# EAGLE design cape (EAGLE 9.4.0)
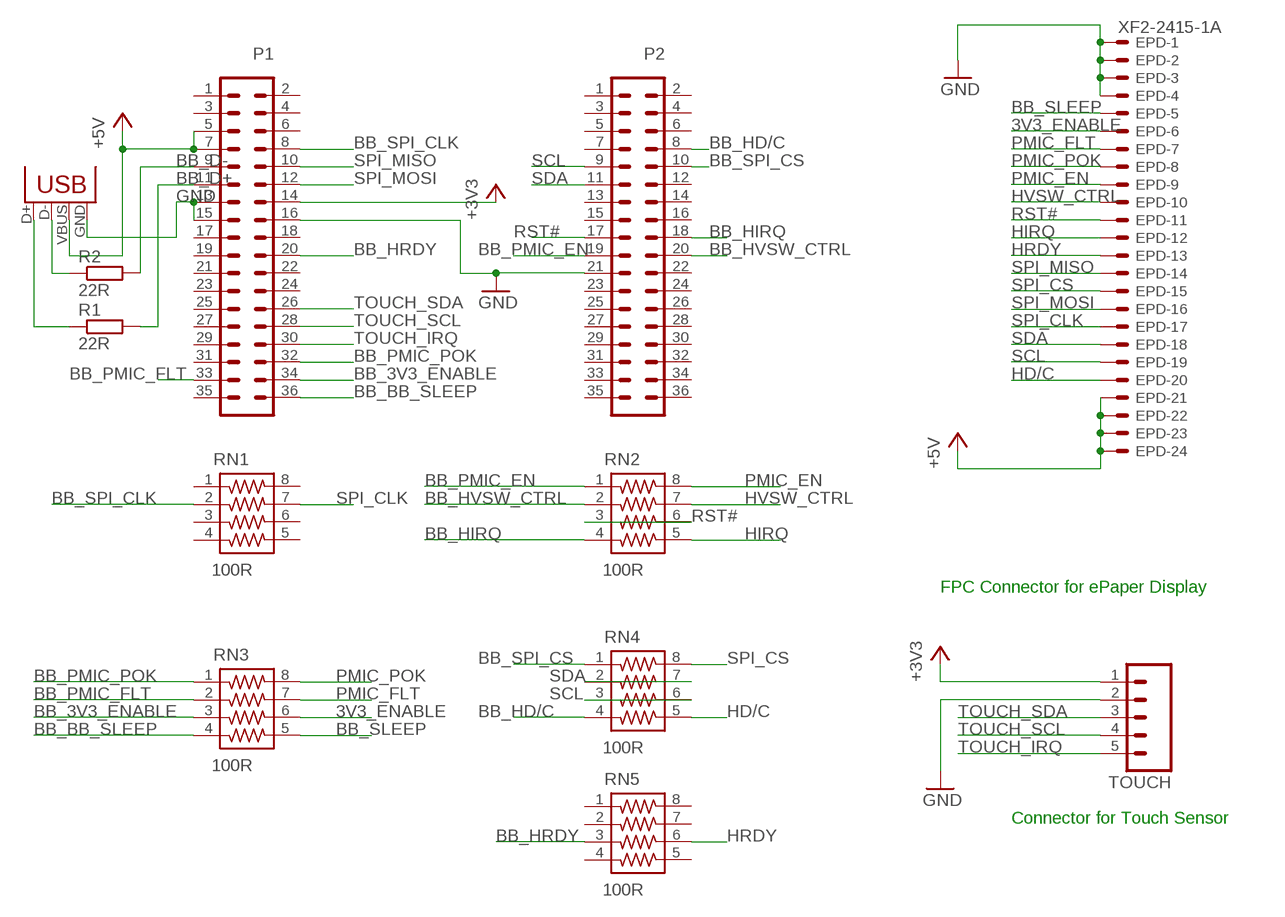
[diagram p0: schematic, sheet 1]

## Parts
EPD  XF2-2415-1A  [XF2M-2415-1A]
P1  MA18-2  [MA18-2]
P2  MA18-2  [MA18-2]
R1  22R  R-EU_R0603  [R0603]
R2  22R  R-EU_R0603  [R0603]
RN1  100R  741-8  [741-8]
RN2  100R  741-8  [741-8]
RN3  100R  741-8  [741-8]
RN4  100R  741-8  [741-8]
RN5  100R  741-8  [741-8]
TOUCH  M05PTH  [1X05]
USB  USB-A-H  [USB-A-H]

## Nets
3V3_ENABLE: EPD.6 RN3.6
+3V3: P1.14 TOUCH.1
+5V: EPD.21 EPD.22 EPD.23 EPD.24 P1.5 P1.7 USB.VBUS
BB_3V3_ENABLE: P1.34 RN3.3
BB_BB_SLEEP: P1.36 RN3.4
BB_D+: P1.11 R1.2
BB_D-: P1.9 R2.2
BB_HD/C: P2.8 RN4.4
BB_HIRQ: P2.18 RN2.4
BB_HRDY: P1.20 RN5.3
BB_HVSW_CTRL: P2.20 RN2.2
BB_PMIC_EN: P2.19 RN2.1
BB_PMIC_FLT: P1.33 RN3.2
BB_PMIC_POK: P1.32 RN3.1
BB_SLEEP: EPD.5 RN3.5
BB_SPI_CLK: P1.8 RN1.2
BB_SPI_CS: P2.10 RN4.1
D+: R1.1 USB.D+
D-: R2.1 USB.D-
GND: EPD.1 EPD.2 EPD.3 EPD.4 P1.13 P1.15 P1.16 P2.21 TOUCH.2 USB.GND
HD/C: EPD.20 RN4.5
HIRQ: EPD.12 RN2.5
HRDY: EPD.13 RN5.6
HVSW_CTRL: EPD.10 RN2.7
PMIC_EN: EPD.9 RN2.8
PMIC_FLT: EPD.7 RN3.7
PMIC_POK: EPD.8 RN3.8
RST#: EPD.11 P2.17 RN2.3 RN2.6
SCL: EPD.19 P2.9 RN4.3 RN4.6
SDA: EPD.18 P2.11 RN4.2 RN4.7
SPI_CLK: EPD.17 RN1.7
SPI_CS: EPD.15 RN4.8
SPI_MISO: EPD.14 P1.10
SPI_MOSI: EPD.16 P1.12
TOUCH_IRQ: P1.30 TOUCH.5
TOUCH_SCL: P1.28 TOUCH.4
TOUCH_SDA: P1.26 TOUCH.3
Unconnected: P1.1 P1.2 P1.3 P1.4 P1.6 P1.17 P1.18 P1.19 P1.21 P1.22 P1.23 P1.24 P1.25 P1.27 P1.29 P1.31 P1.35 P2.1 P2.2 P2.3 P2.4 P2.5 P2.6 P2.7 P2.12 P2.13 P2.14 P2.15 P2.16 P2.22 P2.23 P2.24 P2.25 P2.26 P2.27 P2.28 P2.29 P2.30 P2.31 P2.32 P2.33 P2.34 P2.35 P2.36 RN1.1 RN1.3 RN1.4 RN1.5 RN1.6 RN1.8 RN5.1 RN5.2 RN5.4 RN5.5 RN5.7 RN5.8

## Notes on the sheet
- FPC Connector for ePaper Display
- Connector for Touch Sensor

## Library data of the parts
EPD = con-omron:XF2*-24?: OMRON FPC Connector Source : http://www.omron.com/ecb/products/pdf/fpc.pdf
P1 P2 = con-lstb:MA18-2: PIN HEADER; OC_FARNELL: unknown; OC_NEWARK: unknown
R1 R2 = rcl:R-EU_: RESISTOR, European symbol; SPICEPREFIX: R
RN1-RN5 = resistor-array:741-8: CTS 741 Series 8 Terminations, 4 Resistors
TOUCH = SparkFun:M05: Header 5 Standard 5-pin 0.1" header. Use with straight break away headers (SKU : PRT-00116), right angle break away headers (PRT-00553), swiss pins (PRT-00743), machine pins (PRT-00117), and female headers (PRT-00115). Molex polarized connector foot print use with SKU : PRT-08230 with associated crimp pins and housings.
USB = con-usb:USB: USB Connectors

## Board
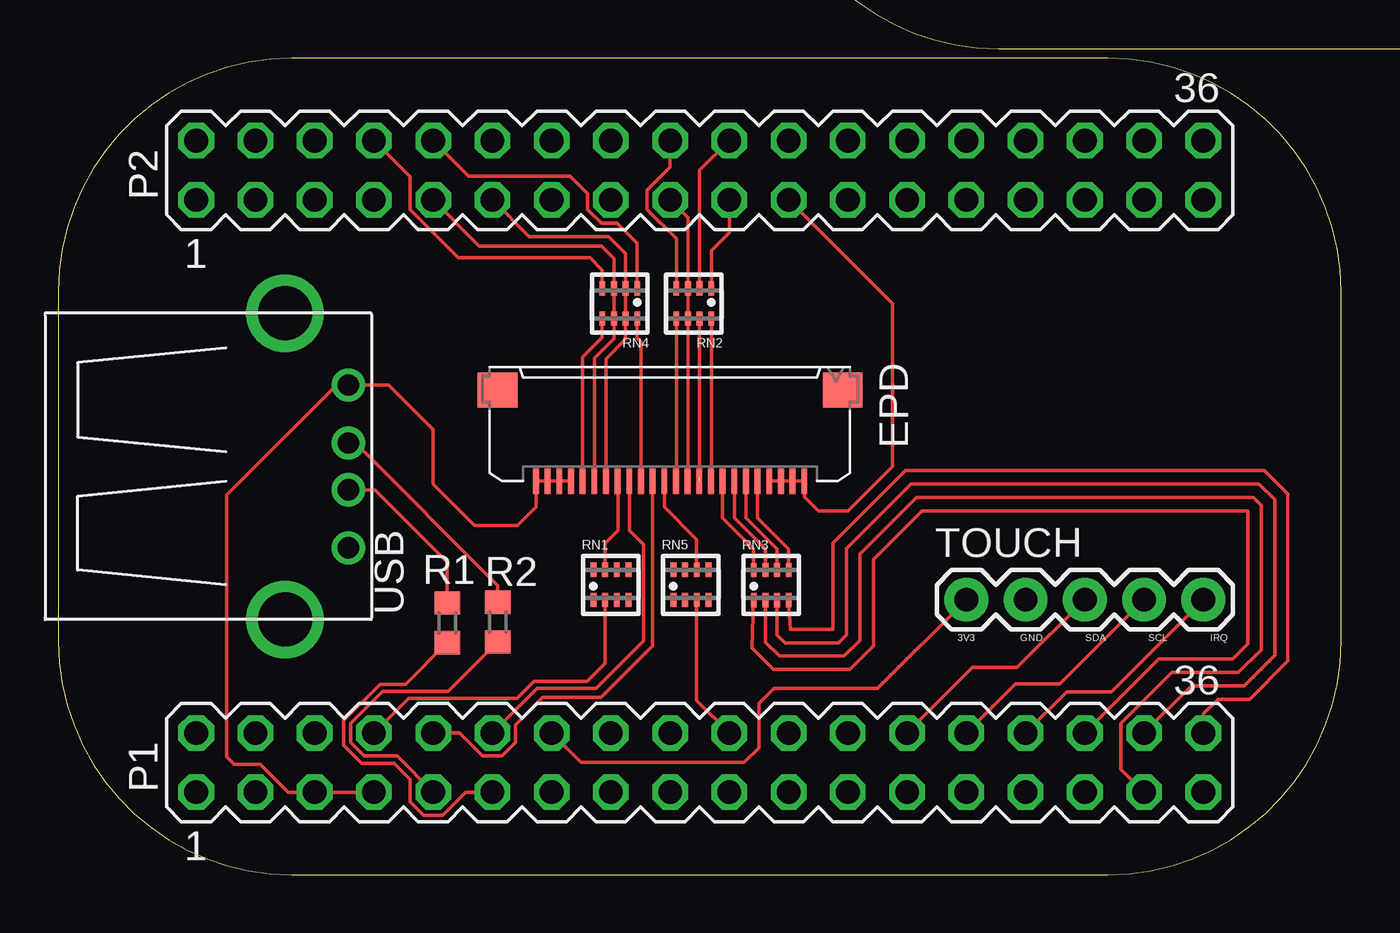
[diagram p1: board, top side]
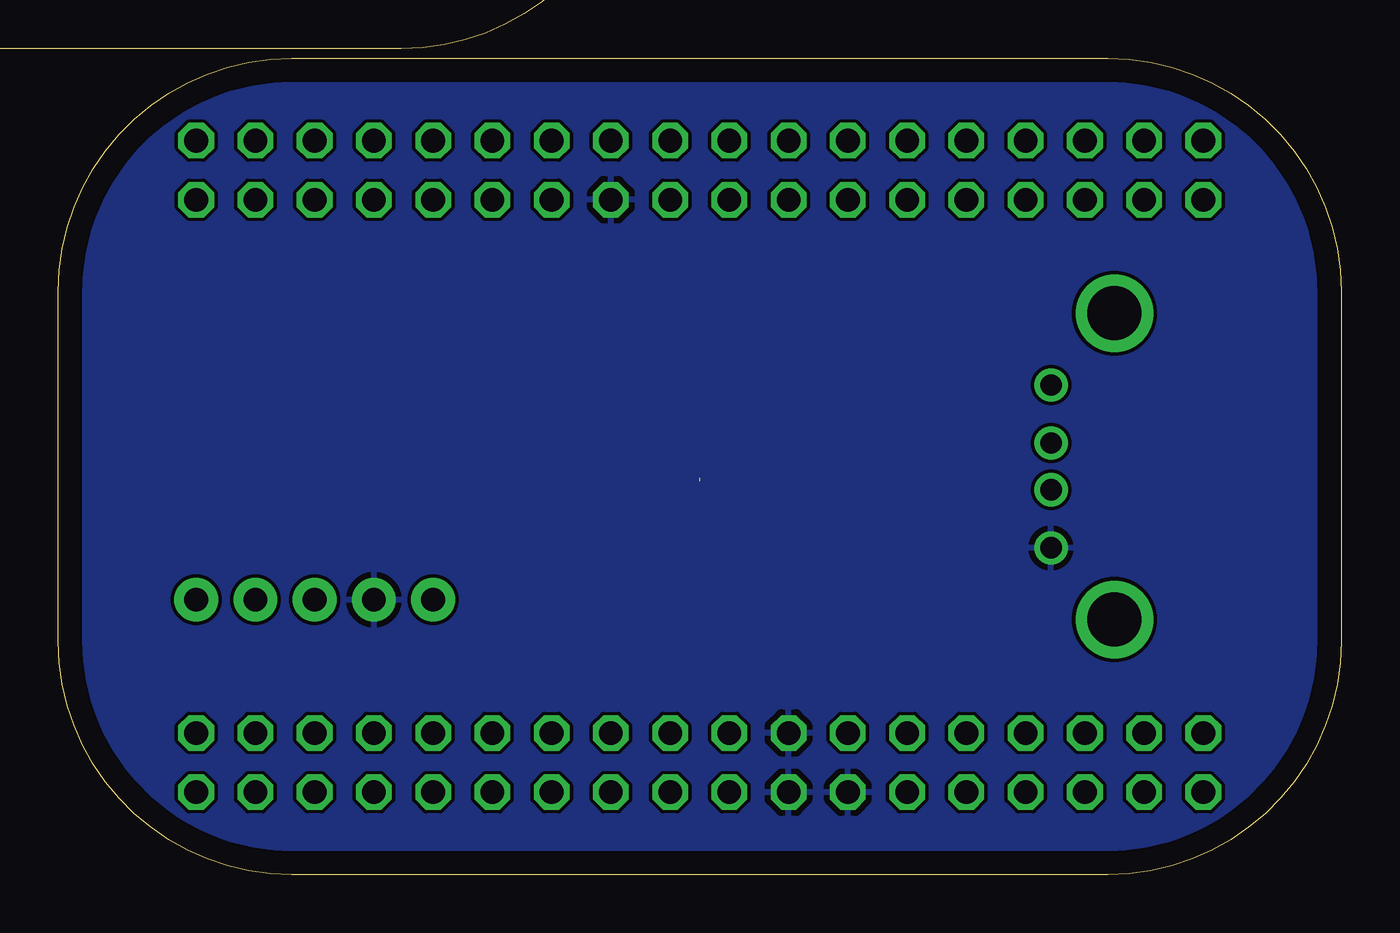
[diagram p2: board, bottom side, seen from below]

Size 55 x 35 mm. Coordinates in mm from the lower left corner, seen from the top.
Outline: 45,35 10,35 arc90 0,25 0,10 arc90 10,0 45,0 arc90 55,10 55,25 arc90 45,35
Copper layers (1*16): Top 0.035mm / dielectric 1.5mm / Bottom 0.035mm
Design rules "default": minimum track width 6mil, minimum drill 0.35mm, track to track 6mil, track to pad 6mil, pad to pad 6mil, via to via 6mil, smd to smd 6mil, copper to edge 40mil, drill to drill 6mil, minimum pad ring 10mil, minimum via ring 8mil, stop-mask expansion 4mil, vias tented up to drill 0mil, thermal gap 10mil
Milling: 8 lines

### Footprints (pad centres in the part's own frame; a part is rotated, then mirrored left to right if it is on the bottom)
XF2M-2415-1A = smd 1.1 x 0.25: 1 2.54,5.75; 2 2.54,5.25; 3 2.54,4.75; 4 2.54,4.25; 5 2.54,3.75; 6 2.54,3.25; 7 2.54,2.75; 8 2.54,2.25; 9 2.54,1.75; 10 2.54,1.25; 11 2.54,0.75; 12 2.54,0.25; 13 2.54,-0.25; 14 2.54,-0.75; 15 2.54,-1.25; 16 2.54,-1.75; 17 2.54,-2.25; 18 2.54,-2.75; 19 2.54,-3.25; 20 2.54,-3.75; 21 2.54,-4.25; 22 2.54,-4.75; 23 2.54,-5.25; 24 2.54,-5.75 | smd 1.5 x 1.7: M1 -1.36,7.4; M2 -1.36,-7.4
MA18-2 = drill 1.016 octagon: 1 -21.59,-1.27; 2 -21.59,1.27; 3 -19.05,-1.27; 4 -19.05,1.27; 5 -16.51,-1.27; 6 -16.51,1.27; 7 -13.97,-1.27; 8 -13.97,1.27; 9 -11.43,-1.27; 10 -11.43,1.27; 11 -8.89,-1.27; 12 -8.89,1.27; 13 -6.35,-1.27; 14 -6.35,1.27; 15 -3.81,-1.27; 16 -3.81,1.27; 17 -1.27,-1.27; 18 -1.27,1.27; 19 1.27,-1.27; 20 1.27,1.27; 21 3.81,-1.27; 22 3.81,1.27; 23 6.35,-1.27; 24 6.35,1.27; 25 8.89,-1.27; 26 8.89,1.27; 27 11.43,-1.27; 28 11.43,1.27; 29 13.97,-1.27; 30 13.97,1.27; 31 16.51,-1.27; 32 16.51,1.27; 33 19.05,-1.27; 34 19.05,1.27; 35 21.59,-1.27; 36 21.59,1.27
R0603 = smd 1 x 1.1: 1 -0.85,0; 2 0.85,0
741-8 = smd 0.25 x 0.61: 1 -0.75,-0.65; 2 -0.25,-0.65; 3 0.25,-0.65; 4 0.75,-0.65; 5 0.75,0.65; 6 0.25,0.65; 7 -0.25,0.65; 8 -0.75,0.65
1X05 = drill 1.016 pad 1.88: 1 0,0; 2 2.54,0; 3 5.08,0; 4 7.62,0; 5 10.16,0
USB-A-H = drill 0.914: D+ 2.718,-1.003; D- 2.718,1.003; GND 2.718,-3.493; VBUS 2.718,3.493 | drill 2.311: P$5 0,-6.566; P$6 0,6.566

### Placement (x,y rotation side)
EPD  26.23,19.41 270 top
P1  27.5,4.8 0 top
P2  27.5,30.2 0 top
R1  16.67,10.8 270 top
R2  18.84,10.83 270 top
RN1  23.69,12.42 0 top
RN2  27.25,24.49 180 top
RN3  30.56,12.41 0 top
RN4  24.07,24.49 180 top
RN5  27.12,12.42 0 top
TOUCH  38.93,11.79 0 top
USB  9.72,17.5 0 top

### Tracks (layer width: path | path; a pad name or v marks a point on that pad's centre or on a via)
3V3_ENABLE
  Top 0.152: RN3.6 30.81,13.95 29.48,15.28 EPD.6
+3V3
  Top 0.152: P1.14 22.42,4.8 29.4,4.8 30.04,5.44 30.04,7.34 30.67,7.98 35.12,7.98 TOUCH.1
+5V
  Top 0.152: P1.7 P1.5 9.85,3.53 8.66,4.72 7.55,4.72 7.22,5.05 7.22,16.27 11.94,20.99 USB.VBUS 14.16,20.99 16.07,19.09 16.07,16.75 17.85,14.96 19.69,14.96 20.48,15.75 EPD.24 EPD.23 EPD.22 EPD.21
BB_3V3_ENABLE
  Top 0.152: P1.34 48.57,8.1 50.84,8.1 52.14,9.4 52.14,16.07 51.47,16.75 36.55,16.75 33.79,13.99 33.79,10.28 33.45,9.94 31.15,9.94 30.81,10.28 RN3.3
BB_BB_SLEEP
  Top 0.152: RN3.4 31.39,10.52 33.21,10.52 33.21,14.23 36.31,17.32 51.71,17.32 52.72,16.31 52.72,9.17 51.07,7.52 49.72,7.52 49.09,6.89 P1.36
BB_D+
  Top 0.152: R1.2 14.89,8.16 13.79,8.16 12.23,6.61 12.23,5.53 12.99,4.78 14.39,4.78 15.08,4.09 15.08,3.12 15.66,2.54 16.48,2.54 17.47,3.53 P1.11
BB_D-
  Top 0.152: R2.2 16.72,7.86 13.91,7.86 12.54,6.48 12.54,5.66 13.12,5.08 14.52,5.08 P1.9
BB_HD/C
  Top 0.152: P2.8 15.08,29.92 15.08,28.52 17.15,26.45 22.79,26.45 23.32,25.92 RN4.4
BB_HIRQ
  Top 0.152: P2.18 26.23,30.33 25.24,29.34 25.24,28.52 26.5,27.26 RN2.4
BB_HRDY
  Top 0.152: P1.20 27.37,7.47 RN5.3
BB_HVSW_CTRL
  Top 0.152: P2.20 27.5,30.2 RN2.2
BB_PMIC_EN
  Top 0.152: P2.19 28.77,27.53 28,26.76 RN2.1
BB_PMIC_FLT
  Top 0.152: P1.33 45.56,4.52 45.56,6.48 47.75,8.67 50.6,8.67 51.57,9.64 51.57,15.83 51.23,16.17 36.79,16.17 34.36,13.75 34.36,10.04 33.69,9.37 30.91,9.37 30.31,9.96 RN3.2
BB_PMIC_POK
  Top 0.152: P1.32 47.18,9.25 50.36,9.25 50.99,9.88 50.99,15.6 37.02,15.6 34.94,13.51 34.94,9.8 33.93,8.79 30.67,8.79 29.74,9.73 RN3.1
BB_SLEEP
  Top 0.152: RN3.5 31.31,13.95 29.98,15.28 EPD.5
BB_SPI_CLK
  Top 0.152: P1.8 15.01,7.55 19.66,7.55 20.39,8.28 22.67,8.28 23.44,9.05 RN1.2
BB_SPI_CS
  Top 0.152: P2.10 17.59,29.95 21.94,29.95 22.7,29.19 22.7,28.52 23.28,27.94 23.95,27.94 24.82,27.07 RN4.1
D+
  Top 0.152: USB.D+ 13.59,16.5 16.67,13.41 R1.1
D-
  Top 0.152: USB.D- 12.74,18.5 18.84,12.4 R2.1
GND
  Top 0.152: 31.98,28.26 P2.21 35.75,24.49 35.75,17.5 33.85,15.6 32.58,15.6 31.98,16.2 EPD.1 EPD.2 EPD.3 EPD.4
  pour Bottom: 0.19,10.19 0.19,24.91 arc-90 9.93,34.65 45.07,34.65 arc-90 54.8,24.91 54.8,10.17 arc-90 44.87,0.23 10.15,0.23 arc-90
HD/C
  Top 0.152: RN4.5 23.32,23.03 22.48,22.19 EPD.20
HIRQ
  Top 0.152: 26.48,23.8 RN2.5 26.5,16.88 EPD.12
HRDY
  Top 0.152: EPD.13 25.98,15.76 27.37,14.37 RN5.6
HVSW_CTRL  (1 unrouted)
  Top 0.152: RN2.7 27.5,17.01
PMIC_EN
  Top 0.152: 27.98,23.76 RN2.8 28,16.88 EPD.9
PMIC_FLT
  Top 0.152: RN3.7 30.31,13.95 28.98,15.28 EPD.7
PMIC_POK
  Top 0.152: RN3.8 29.81,13.95 28.48,15.28 EPD.8
RST#
  Top 0.152: P2.17 27,28.16 RN2.3 RN2.6 27,16.88 EPD.11
SCL
  Top 0.152: P2.9 18.05,26.95 23.29,26.95 23.82,26.42 RN4.3 RN4.6 23.82,22.98 22.98,22.14 EPD.19
SDA
  Top 0.152: P2.11 20.19,27.35 23.59,27.35 24.32,26.62 RN4.2 RN4.7 24.32,22.95 23.48,22.11 EPD.18
SPI_CLK
  Top 0.152: RN1.7 23.44,14.2 23.99,14.75 23.99,16.86 EPD.17
SPI_CS
  Top 0.152: RN4.8 24.82,23 24.98,22.84 EPD.15
SPI_MISO
  Top 0.152: P1.10 17.21,6.07 18.2,5.08 19.02,5.08 19.6,5.66 19.6,6.43 20.76,7.59 23.27,7.59 25.48,9.8 EPD.14
SPI_MOSI
  Top 0.152: P1.12 20.51,7.98 23.05,7.98 25.09,10.01 25.09,14.15 24.48,14.76 EPD.16
TOUCH_IRQ
  Top 0.152: TOUCH.5 45.14,7.84 43.24,7.84 P1.30
TOUCH_SCL
  Top 0.152: TOUCH.4 42.93,8.17 41.03,8.17 P1.28
TOUCH_SDA
  Top 0.152: TOUCH.3 41.1,8.88 39.2,8.88 P1.26

### Text on the board
tNames: 3V3 GND SDA SCL IRQ